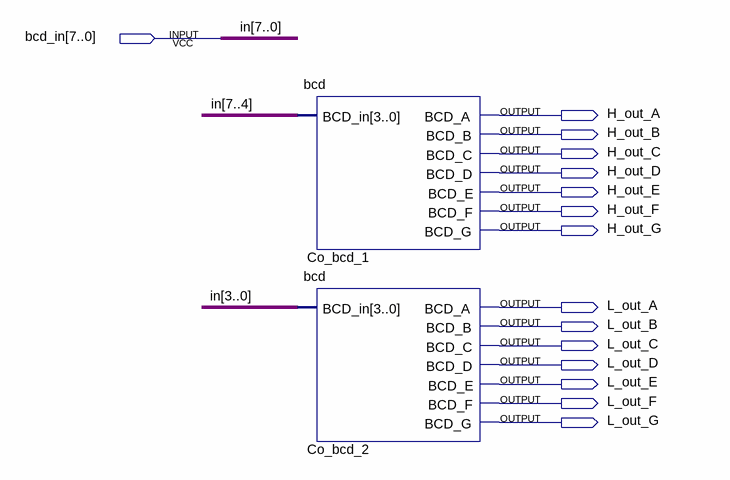
[diagram p0: schematic sheet]
// Quartus schematic bcd2.bdf as structural Verilog: 2 symbols, 15 pins
module bcd2 (
  input  [7:0] bcd_in,
  output H_out_A,
  output H_out_B,
  output H_out_C,
  output H_out_D,
  output H_out_E,
  output H_out_F,
  output H_out_G,
  output L_out_A,
  output L_out_B,
  output L_out_C,
  output L_out_D,
  output L_out_E,
  output L_out_F,
  output L_out_G
);

  bcd Co_bcd_1 (
    .BCD_in(bcd_in[7:4]), .BCD_A(H_out_A), .BCD_B(H_out_B), .BCD_C(H_out_C), .BCD_D(H_out_D),
    .BCD_E(H_out_E), .BCD_F(H_out_F), .BCD_G(H_out_G));
  bcd Co_bcd_2 (
    .BCD_in(bcd_in[3:0]), .BCD_A(L_out_A), .BCD_B(L_out_B), .BCD_C(L_out_C), .BCD_D(L_out_D),
    .BCD_E(L_out_E), .BCD_F(L_out_F), .BCD_G(L_out_G));

  // Other names for the same wires on the sheet: in[7:0] = bcd_in
endmodule
